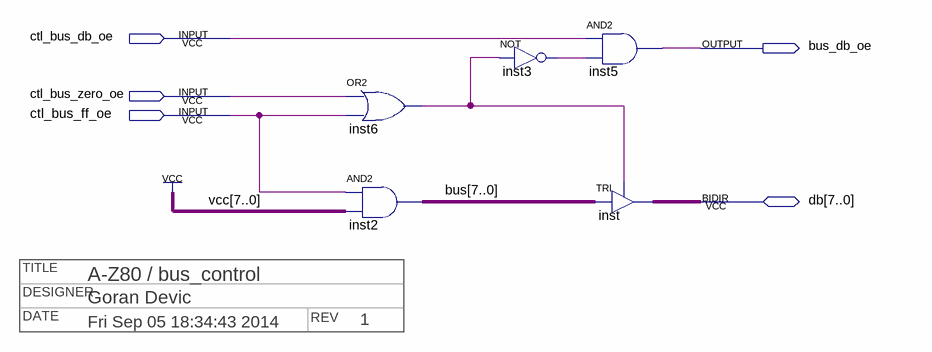
[diagram p0: schematic sheet]
// Quartus schematic bus_control.bdf as structural Verilog: 5 symbols, 5 pins
// Title block: TITLE: A-Z80 / bus_control; DESIGNER: Goran Devic; DATE: Fri Sep 05 18:34:43 2014; REV: 1
module bus_control (
  input  ctl_bus_db_oe,
  input  ctl_bus_zero_oe,
  input  ctl_bus_ff_oe,
  inout  [7:0] db,
  output bus_db_oe
);

  wire inst3_out, inst6_out;
  wire [7:0] bus;

  or inst6 (inst6_out, ctl_bus_zero_oe, ctl_bus_ff_oe);
  assign bus = {8{ctl_bus_ff_oe}} & {8{1'b1}};  // AND2 inst2, 8 bits wide
  not inst3 (inst3_out, inst6_out);
  and inst5 (bus_db_oe, ctl_bus_db_oe, inst3_out);
  TRI inst[7:0] (.IN(bus), .OE(inst6_out), .OUT(db));
endmodule
